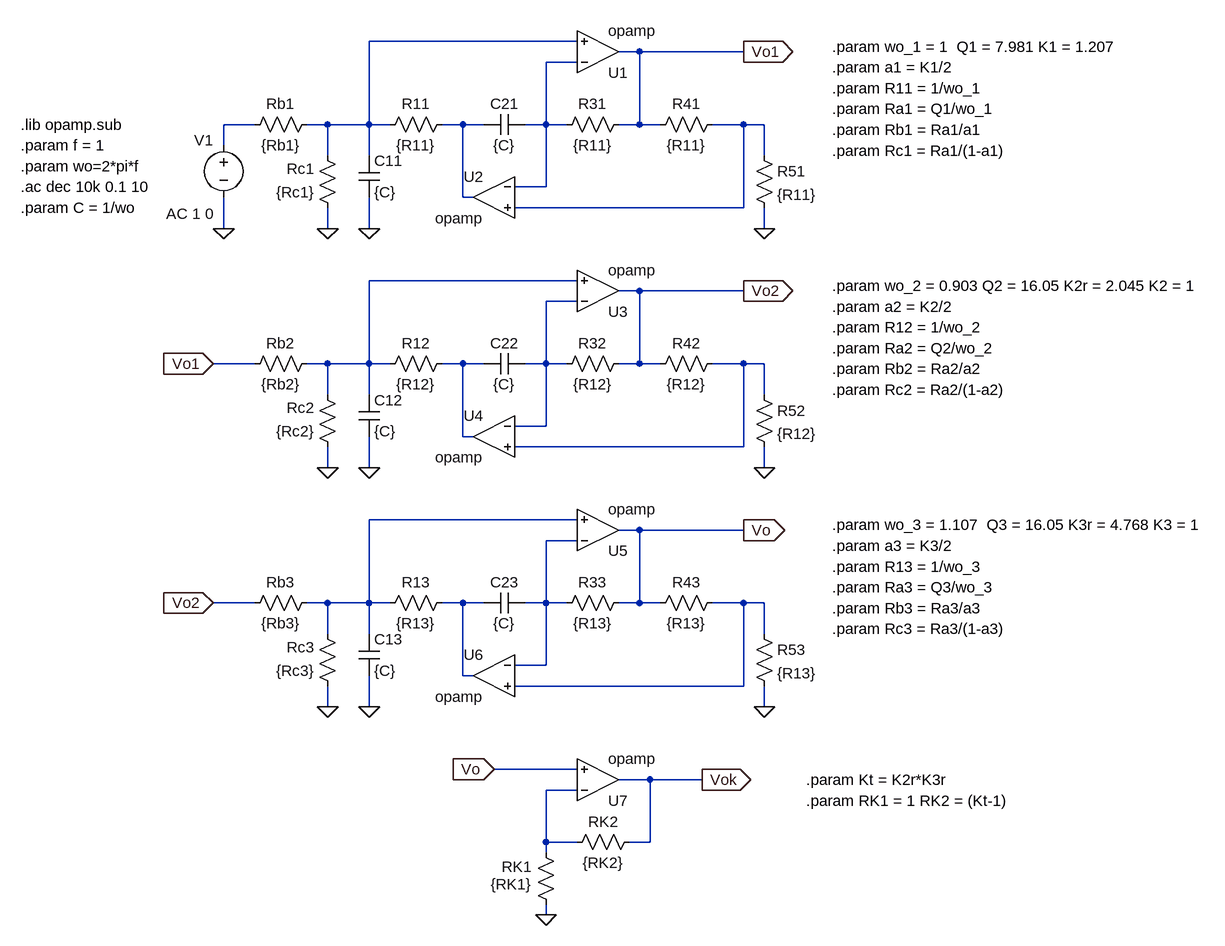
[diagram p0: schematic TS4bis2_activo.asc]
TS4bis2_activo.asc, the LTspice schematic file:
Version 4
SHEET 1 1400 1316
WIRE 400 -48 80 -48
WIRE 496 -32 464 -32
WIRE 656 -32 496 -32
WIRE 400 -16 352 -16
WIRE -96 80 -144 80
WIRE 16 80 -16 80
WIRE 80 80 80 -48
WIRE 80 80 16 80
WIRE 112 80 80 80
WIRE 224 80 192 80
WIRE 256 80 224 80
WIRE 352 80 352 -16
WIRE 352 80 320 80
WIRE 384 80 352 80
WIRE 496 80 496 -32
WIRE 496 80 464 80
WIRE 528 80 496 80
WIRE 656 80 608 80
WIRE 688 80 656 80
WIRE -144 112 -144 80
WIRE 16 128 16 80
WIRE 80 128 80 80
WIRE 688 128 688 80
WIRE 352 176 352 80
WIRE 352 176 304 176
WIRE 224 192 224 80
WIRE 240 192 224 192
WIRE 656 208 656 80
WIRE 656 208 304 208
WIRE -144 240 -144 192
WIRE 16 240 16 208
WIRE 80 240 80 192
WIRE 688 240 688 208
WIRE 400 320 80 320
WIRE 496 336 464 336
WIRE 656 336 496 336
WIRE 400 352 352 352
WIRE -96 448 -160 448
WIRE 16 448 -16 448
WIRE 80 448 80 320
WIRE 80 448 16 448
WIRE 112 448 80 448
WIRE 224 448 192 448
WIRE 256 448 224 448
WIRE 352 448 352 352
WIRE 352 448 320 448
WIRE 384 448 352 448
WIRE 496 448 496 336
WIRE 496 448 464 448
WIRE 528 448 496 448
WIRE 656 448 608 448
WIRE 688 448 656 448
WIRE 16 496 16 448
WIRE 80 496 80 448
WIRE 688 496 688 448
WIRE 352 544 352 448
WIRE 352 544 304 544
WIRE 224 560 224 448
WIRE 240 560 224 560
WIRE 656 576 656 448
WIRE 656 576 304 576
WIRE 16 608 16 576
WIRE 80 608 80 560
WIRE 688 608 688 576
WIRE 400 688 80 688
WIRE 496 704 464 704
WIRE 656 704 496 704
WIRE 400 720 352 720
WIRE -96 816 -160 816
WIRE 16 816 -16 816
WIRE 80 816 80 688
WIRE 80 816 16 816
WIRE 112 816 80 816
WIRE 224 816 192 816
WIRE 256 816 224 816
WIRE 352 816 352 720
WIRE 352 816 320 816
WIRE 384 816 352 816
WIRE 496 816 496 704
WIRE 496 816 464 816
WIRE 528 816 496 816
WIRE 656 816 608 816
WIRE 688 816 656 816
WIRE 16 864 16 816
WIRE 80 864 80 816
WIRE 688 864 688 816
WIRE 352 912 352 816
WIRE 352 912 304 912
WIRE 224 928 224 816
WIRE 240 928 224 928
WIRE 656 944 656 816
WIRE 656 944 304 944
WIRE 16 976 16 944
WIRE 80 976 80 928
WIRE 688 976 688 944
WIRE 400 1072 272 1072
WIRE 512 1088 464 1088
WIRE 592 1088 512 1088
WIRE 400 1104 352 1104
WIRE 352 1184 352 1104
WIRE 400 1184 352 1184
WIRE 512 1184 512 1088
WIRE 512 1184 480 1184
WIRE 352 1200 352 1184
WIRE 352 1296 352 1280
FLAG 80 240 0
FLAG 16 240 0
FLAG 688 240 0
FLAG 656 -32 Vo1
IOPIN 656 -32 Out
FLAG -144 240 0
FLAG 80 608 0
FLAG 16 608 0
FLAG 688 608 0
FLAG 656 336 Vo2
IOPIN 656 336 Out
FLAG 80 976 0
FLAG 16 976 0
FLAG 688 976 0
FLAG 656 704 Vo
IOPIN 656 704 Out
FLAG -160 448 Vo1
IOPIN -160 448 In
FLAG -160 816 Vo2
IOPIN -160 816 In
FLAG 352 1296 0
FLAG 272 1072 Vo
IOPIN 272 1072 In
FLAG 592 1088 Vok
IOPIN 592 1088 Out
SYMBOL res 0 64 R90
WINDOW 0 0 56 VBottom 2
WINDOW 3 32 56 VTop 2
SYMATTR InstName Rb1
SYMATTR Value {Rb1}
SYMBOL res 32 224 R180
WINDOW 0 36 76 Left 2
WINDOW 3 36 40 Left 2
SYMATTR InstName Rc1
SYMATTR Value {Rc1}
SYMBOL res 96 96 R270
WINDOW 0 32 56 VTop 2
WINDOW 3 0 56 VBottom 2
SYMATTR InstName R11
SYMATTR Value {R11}
SYMBOL res 368 96 R270
WINDOW 0 32 56 VTop 2
WINDOW 3 0 56 VBottom 2
SYMATTR InstName R31
SYMATTR Value {R11}
SYMBOL res 512 96 R270
WINDOW 0 32 56 VTop 2
WINDOW 3 0 56 VBottom 2
SYMATTR InstName R41
SYMATTR Value {R11}
SYMBOL res 672 112 R0
SYMATTR InstName R51
SYMATTR Value {R11}
SYMBOL cap 64 128 R0
SYMATTR InstName C11
SYMATTR Value {C}
SYMBOL cap 320 64 R90
WINDOW 0 0 32 VBottom 2
WINDOW 3 32 32 VTop 2
SYMATTR InstName C21
SYMATTR Value {C}
SYMBOL OpAmps\\opamp 432 32 M180
SYMATTR InstName U1
SYMBOL OpAmps\\opamp 272 128 M0
SYMATTR InstName U2
SYMBOL voltage -144 96 R0
WINDOW 0 -45 8 Left 2
WINDOW 123 -88 121 Left 2
WINDOW 39 0 0 Left 0
SYMATTR InstName V1
SYMATTR Value2 AC 1 0
SYMATTR Value ""
SYMBOL res 0 432 R90
WINDOW 0 0 56 VBottom 2
WINDOW 3 32 56 VTop 2
SYMATTR InstName Rb2
SYMATTR Value {Rb2}
SYMBOL res 32 592 R180
WINDOW 0 36 76 Left 2
WINDOW 3 36 40 Left 2
SYMATTR InstName Rc2
SYMATTR Value {Rc2}
SYMBOL res 96 464 R270
WINDOW 0 32 56 VTop 2
WINDOW 3 0 56 VBottom 2
SYMATTR InstName R12
SYMATTR Value {R12}
SYMBOL res 368 464 R270
WINDOW 0 32 56 VTop 2
WINDOW 3 0 56 VBottom 2
SYMATTR InstName R32
SYMATTR Value {R12}
SYMBOL res 512 464 R270
WINDOW 0 32 56 VTop 2
WINDOW 3 0 56 VBottom 2
SYMATTR InstName R42
SYMATTR Value {R12}
SYMBOL res 672 480 R0
SYMATTR InstName R52
SYMATTR Value {R12}
SYMBOL cap 64 496 R0
SYMATTR InstName C12
SYMATTR Value {C}
SYMBOL cap 320 432 R90
WINDOW 0 0 32 VBottom 2
WINDOW 3 32 32 VTop 2
SYMATTR InstName C22
SYMATTR Value {C}
SYMBOL OpAmps\\opamp 432 400 M180
SYMATTR InstName U3
SYMBOL OpAmps\\opamp 272 496 M0
SYMATTR InstName U4
SYMBOL res 0 800 R90
WINDOW 0 0 56 VBottom 2
WINDOW 3 32 56 VTop 2
SYMATTR InstName Rb3
SYMATTR Value {Rb3}
SYMBOL res 32 960 R180
WINDOW 0 36 76 Left 2
WINDOW 3 36 40 Left 2
SYMATTR InstName Rc3
SYMATTR Value {Rc3}
SYMBOL res 96 832 R270
WINDOW 0 32 56 VTop 2
WINDOW 3 0 56 VBottom 2
SYMATTR InstName R13
SYMATTR Value {R13}
SYMBOL res 368 832 R270
WINDOW 0 32 56 VTop 2
WINDOW 3 0 56 VBottom 2
SYMATTR InstName R33
SYMATTR Value {R13}
SYMBOL res 512 832 R270
WINDOW 0 32 56 VTop 2
WINDOW 3 0 56 VBottom 2
SYMATTR InstName R43
SYMATTR Value {R13}
SYMBOL res 672 848 R0
SYMATTR InstName R53
SYMATTR Value {R13}
SYMBOL cap 64 864 R0
SYMATTR InstName C13
SYMATTR Value {C}
SYMBOL cap 320 800 R90
WINDOW 0 0 32 VBottom 2
WINDOW 3 32 32 VTop 2
SYMATTR InstName C23
SYMATTR Value {C}
SYMBOL OpAmps\\opamp 432 768 M180
SYMATTR InstName U5
SYMBOL OpAmps\\opamp 272 864 M0
SYMATTR InstName U6
SYMBOL OpAmps\\opamp 432 1152 M180
SYMATTR InstName U7
SYMBOL res 336 1184 R0
WINDOW 0 -52 38 Left 2
WINDOW 3 -69 65 Left 2
SYMATTR InstName RK1
SYMATTR Value {RK1}
SYMBOL res 496 1168 R90
WINDOW 0 0 56 VBottom 2
WINDOW 3 32 56 VTop 2
SYMATTR InstName RK2
SYMATTR Value {RK2}
TEXT -456 80 Left 2 !.lib opamp.sub
TEXT -456 112 Left 2 !.param f = 1
TEXT -456 144 Left 2 !.param wo=2*pi*f
TEXT -456 176 Left 2 !.ac dec 10k 0.1 10
TEXT 792 -40 Left 2 !.param wo_1 = 1  Q1 = 7.981 K1 = 1.207
TEXT -456 208 Left 2 !.param C = 1/wo
TEXT 792 24 Left 2 !.param R11 = 1/wo_1
TEXT 792 88 Left 2 !.param Rb1 = Ra1/a1
TEXT 792 -8 Left 2 !.param a1 = K1/2
TEXT 792 120 Left 2 !.param Rc1 = Ra1/(1-a1)
TEXT 792 328 Left 2 !.param wo_2 = 0.903 Q2 = 16.05 K2r = 2.045 K2 = 1
TEXT 792 392 Left 2 !.param R12 = 1/wo_2
TEXT 792 456 Left 2 !.param Rb2 = Ra2/a2
TEXT 792 360 Left 2 !.param a2 = K2/2
TEXT 792 488 Left 2 !.param Rc2 = Ra2/(1-a2)
TEXT 792 696 Left 2 !.param wo_3 = 1.107  Q3 = 16.05 K3r = 4.768 K3 = 1
TEXT 792 760 Left 2 !.param R13 = 1/wo_3
TEXT 792 824 Left 2 !.param Rb3 = Ra3/a3
TEXT 792 728 Left 2 !.param a3 = K3/2
TEXT 792 856 Left 2 !.param Rc3 = Ra3/(1-a3)
TEXT 792 56 Left 2 !.param Ra1 = Q1/wo_1
TEXT 792 424 Left 2 !.param Ra2 = Q2/wo_2
TEXT 792 792 Left 2 !.param Ra3 = Q3/wo_3
TEXT 752 1088 Left 2 !.param Kt = K2r*K3r
TEXT 752 1120 Left 2 !.param RK1 = 1 RK2 = (Kt-1)

The netlist it stands for:
* TS4bis2_activo.asc
Rb1 N001 N003 {Rb1}
Rc1 0 N001 {Rc1}
R11 N001 N004 {R11}
R31 N002 Vo1 {R11}
R41 Vo1 N005 {R11}
R51 N005 0 {R11}
C11 N001 0 {C}
C21 N002 N004 {C}
XU1 N002 N001 Vo1 opamp Aol=100K GBW=10Meg  ; pins invin noninvin out
XU2 N002 N005 N004 opamp Aol=100K GBW=10Meg  ; pins invin noninvin out
V1 N003 0 AC 1 0
Rb2 N006 Vo1 {Rb2}
Rc2 0 N006 {Rc2}
R12 N006 N008 {R12}
R32 N007 Vo2 {R12}
R42 Vo2 N009 {R12}
R52 N009 0 {R12}
C12 N006 0 {C}
C22 N007 N008 {C}
XU3 N007 N006 Vo2 opamp Aol=100K GBW=10Meg  ; pins invin noninvin out
XU4 N007 N009 N008 opamp Aol=100K GBW=10Meg  ; pins invin noninvin out
Rb3 N010 Vo2 {Rb3}
Rc3 0 N010 {Rc3}
R13 N010 N012 {R13}
R33 N011 Vo {R13}
R43 Vo N013 {R13}
R53 N013 0 {R13}
C13 N010 0 {C}
C23 N011 N012 {C}
XU5 N011 N010 Vo opamp Aol=100K GBW=10Meg  ; pins invin noninvin out
XU6 N011 N013 N012 opamp Aol=100K GBW=10Meg  ; pins invin noninvin out
XU7 N014 Vo Vok opamp Aol=100K GBW=10Meg  ; pins invin noninvin out
RK1 N014 0 {RK1}
RK2 Vok N014 {RK2}
.lib opamp.sub
.param f = 1
.param wo=2*pi*f
.ac dec 10k 0.1 10
.param wo_1 = 1  Q1 = 7.981 K1 = 1.207
.param C = 1/wo
.param R11 = 1/wo_1
.param Rb1 = Ra1/a1
.param a1 = K1/2
.param Rc1 = Ra1/(1-a1)
.param wo_2 = 0.903 Q2 = 16.05 K2r = 2.045 K2 = 1
.param R12 = 1/wo_2
.param Rb2 = Ra2/a2
.param a2 = K2/2
.param Rc2 = Ra2/(1-a2)
.param wo_3 = 1.107  Q3 = 16.05 K3r = 4.768 K3 = 1
.param R13 = 1/wo_3
.param Rb3 = Ra3/a3
.param a3 = K3/2
.param Rc3 = Ra3/(1-a3)
.param Ra1 = Q1/wo_1
.param Ra2 = Q2/wo_2
.param Ra3 = Q3/wo_3
.param Kt = K2r*K3r
.param RK1 = 1 RK2 = (Kt-1)
.backanno
.end